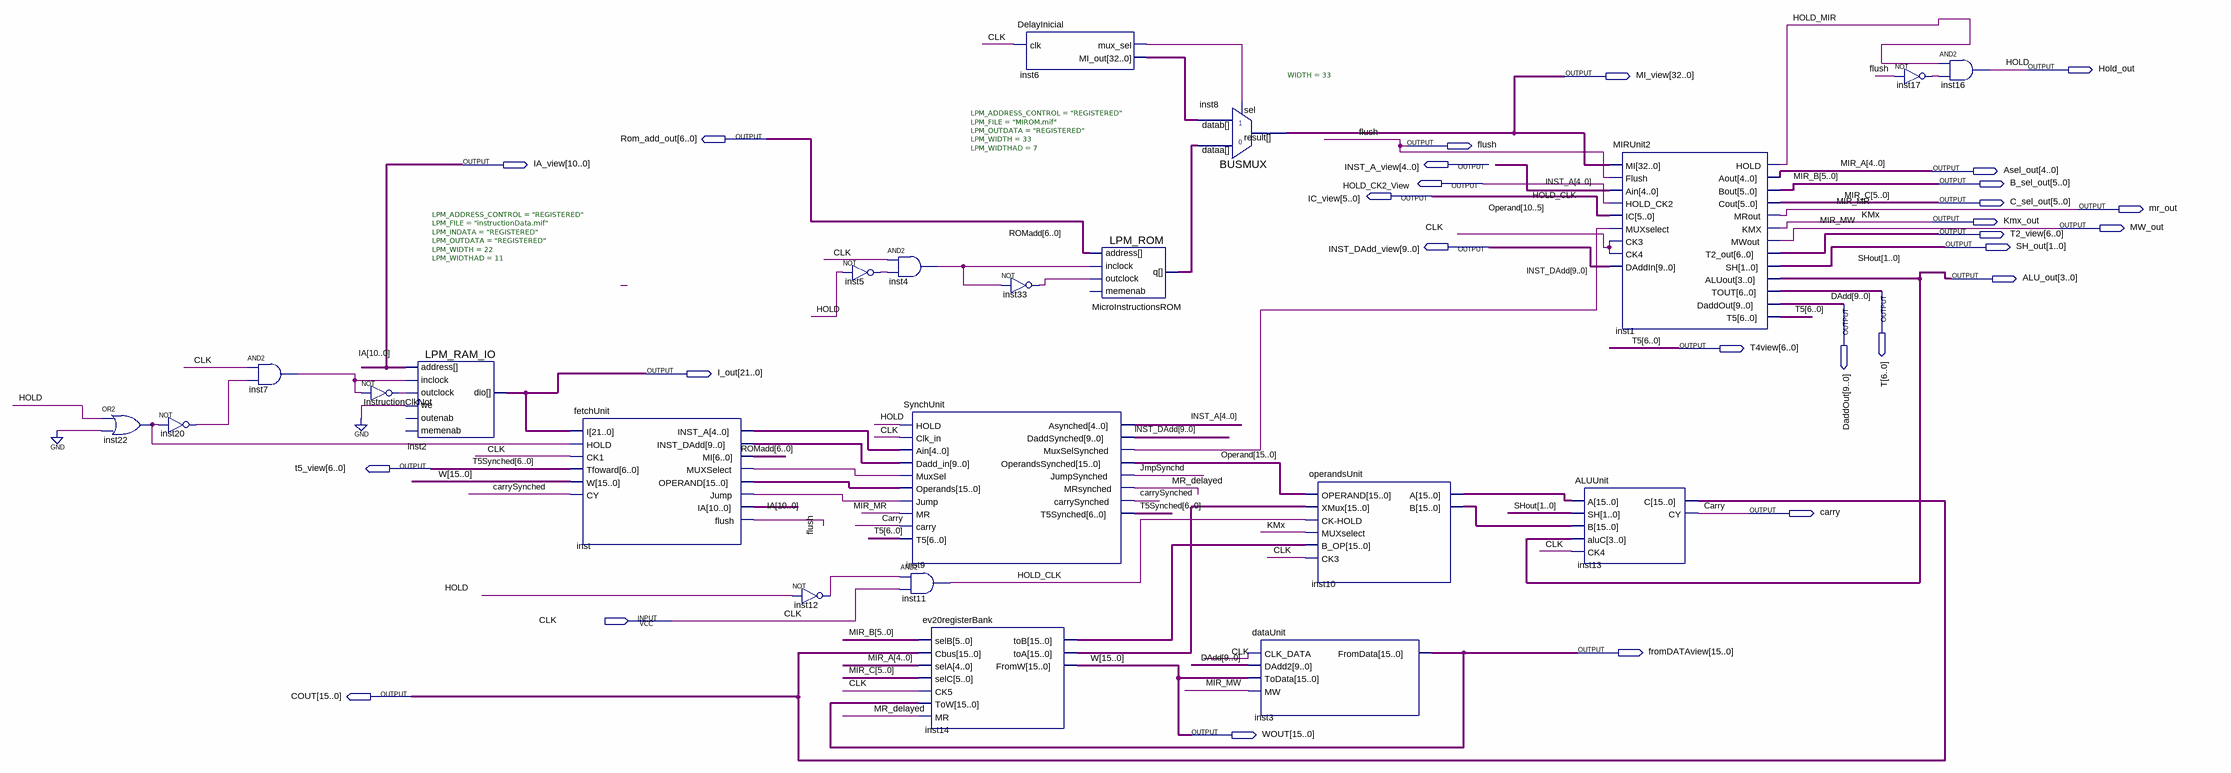
[diagram p0: schematic sheet]
// Quartus schematic ev20main.bdf as structural Verilog: 22 symbols, 28 pins
module ev20main (
  input  CLK,
  output Hold_out,
  output [32:0] MI_view,
  output [6:0] Rom_add_out,
  output flush,
  output [10:0] IA_view,
  output [4:0] INST_A_view,
  output [4:0] Asel_out,
  output HOLD_CK2_View,
  output [5:0] B_sel_out,
  output [5:0] IC_view,
  output [5:0] C_sel_out,
  output mr_out,
  output Kmx_out,
  output MW_out,
  output [6:0] T2_view,
  output [9:0] INST_DAdd_view,
  output [1:0] SH_out,
  output [3:0] ALU_out,
  output [6:0] T,
  output [9:0] DaddOut,
  output [6:0] T4view,
  output [21:0] I_out,
  output [6:0] t5_view,
  output carry,
  output [15:0] fromDATAview,
  output [15:0] COUT,
  output [15:0] WOUT
);

  wire carrySynched, HOLD_MIR, inst4_out, inst5_out, inst6_mux_sel, inst7_out, inst9_muxselsynched,
       inst12_out, inst17_out, inst20_out, inst22_out, inst33_out, inst_jump, inst_muxselect,
       InstructionClkNot_out, JmpSynchd, MR_delayed;
  wire [4:0] INST_A, inst_inst_a;
  wire [9:0] inst_inst_dadd;
  wire [15:0] inst10_a, inst10_b, inst14_toa, inst14_tob, inst_operand, Operand;
  wire [32:0] inst6_mi_out, MicroInstructionsROM_q;

  or inst22 (inst22_out, Hold_out, 1'b0);
  not inst20 (inst20_out, inst22_out);
  and inst7 (inst7_out, CLK, inst20_out);
  not InstructionClkNot (InstructionClkNot_out, inst7_out);
  LPM_RAM_IO #(.LPM_ADDRESS_CONTROL("REGISTERED"), .LPM_FILE("instructionData.mif"), .LPM_INDATA("REGISTERED"), .LPM_OUTDATA("REGISTERED"), .LPM_WIDTH(22), .LPM_WIDTHAD(11)) inst2 (
    .address(IA_view), .outclock(InstructionClkNot_out), .inclock(inst7_out), .we(1'b0), .dio(I_out));  // open: memenab, outenab
  fetchUnit inst (
    .I(I_out), .HOLD(inst22_out), .CK1(CLK), .Tfoward(t5_view), .W(WOUT), .CY(carrySynched),
    .INST_A(inst_inst_a), .INST_DAdd(inst_inst_dadd), .MI(Rom_add_out), .MUXSelect(inst_muxselect),
    .OPERAND(inst_operand), .Jump(inst_jump), .IA(IA_view), .flush(flush));
  not inst12 (inst12_out, Hold_out);
  not inst5 (inst5_out, Hold_out);
  and inst4 (inst4_out, CLK, inst5_out);
  SynchUnit inst9 (
    .HOLD(Hold_out), .Clk_in(CLK), .Ain(inst_inst_a), .Dadd_in(inst_inst_dadd), .MuxSel(inst_muxselect),
    .Operands(inst_operand), .Jump(inst_jump), .MR(mr_out), .carry(carry), .T5(T4view), .Asynched(INST_A),
    .DaddSynched(INST_DAdd_view), .MuxSelSynched(inst9_muxselsynched),
    .OperandsSynched({Operand[15:11], IC_view, Operand[4:0]}), .JumpSynched(JmpSynchd),
    .MRsynched(MR_delayed), .carrySynched(carrySynched), .T5Synched(t5_view));
  and inst11 (HOLD_CK2_View, inst12_out, CLK);
  ev20registerBank inst14 (
    .selB(B_sel_out), .Cbus(COUT), .selA(Asel_out), .selC(C_sel_out), .CK5(CLK), .ToW(fromDATAview),
    .MR(MR_delayed), .toB(inst14_tob), .toA(inst14_toa), .FromW(WOUT));
  DelayInicial inst6 (.clk(CLK), .mux_sel(inst6_mux_sel), .MI_out(inst6_mi_out));
  not inst33 (inst33_out, inst4_out);
  LPM_ROM #(.LPM_ADDRESS_CONTROL("REGISTERED"), .LPM_FILE("MIROM.mif"), .LPM_OUTDATA("REGISTERED"), .LPM_WIDTH(33), .LPM_WIDTHAD(7)) MicroInstructionsROM (
    .address(Rom_add_out), .inclock(inst4_out), .outclock(inst33_out), .q(MicroInstructionsROM_q));  // open: memenab
  BUSMUX #(.WIDTH(33)) inst8 (
    .datab(inst6_mi_out), .sel(inst6_mux_sel), .dataa(MicroInstructionsROM_q), .result(MI_view));
  dataUnit inst3 (.CLK_DATA(CLK), .DAdd2(DaddOut), .ToData(WOUT), .MW(MW_out), .FromData(fromDATAview));
  operandsUnit inst10 (
    .OPERAND({Operand[15:11], IC_view, Operand[4:0]}), .XMux(inst14_toa), .\CK-HOLD (HOLD_CK2_View),
    .MUXselect(Kmx_out), .B_OP(inst14_tob), .CK3(CLK), .A(inst10_a), .B(inst10_b));
  ALUUnit inst13 (.A(inst10_a), .SH(SH_out), .B(inst10_b), .aluC(ALU_out), .CK4(CLK), .C(COUT), .CY(carry));
  MIRUnit2 inst1 (
    .MI(MI_view), .Flush(flush), .Ain(INST_A), .HOLD_CK2(HOLD_CK2_View), .IC(IC_view),
    .MUXselect(inst9_muxselsynched), .CK3(CLK), .CK4(CLK), .DAddIn(INST_DAdd_view), .HOLD(HOLD_MIR),
    .Aout(Asel_out), .Bout(B_sel_out), .Cout(C_sel_out), .MRout(mr_out), .KMX(Kmx_out), .MWout(MW_out),
    .T2_out(T2_view), .SH(SH_out), .ALUout(ALU_out), .TOUT(T), .DaddOut(DaddOut), .T5(T4view));
  not inst17 (inst17_out, flush);
  and inst16 (Hold_out, HOLD_MIR, inst17_out);

  // Other names for the same wires on the sheet: DAdd[9:0] = DaddOut; HOLD = Hold_out; HOLD_CLK = HOLD_CK2_View;
  //   IA[10:0] = IA_view; Operand[10:5] = IC_view; INST_DAdd[9:0] = INST_DAdd_view; KMx = Kmx_out;
  //   MIR_A[4:0] = Asel_out; MIR_B[5:0] = B_sel_out; MIR_C[5:0] = C_sel_out; MIR_MR = mr_out; MIR_MW = MW_out;
  //   ROMadd[6:0] = Rom_add_out; SHout[1:0] = SH_out; T5[6:0] = T4view; T5Synched[6:0] = t5_view; W[15:0] = WOUT
endmodule
